# EasyEDA Pro project ProPrj_PCB_2025-05-19.epro, board 手掌0.2
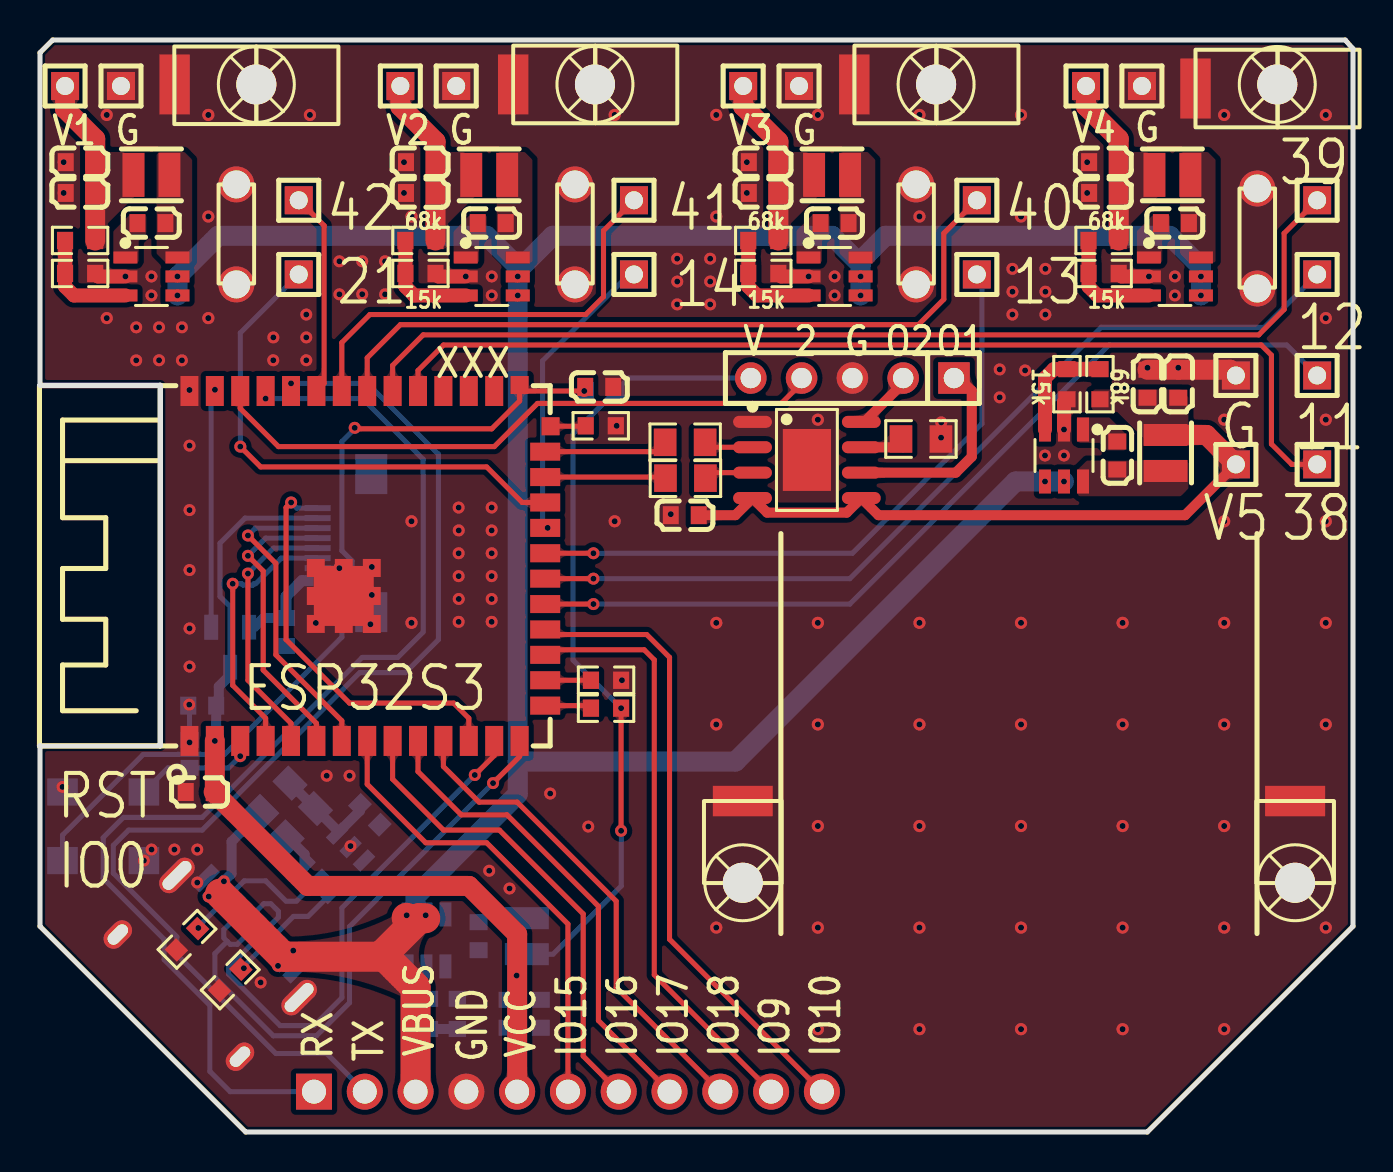
[diagram p12: board, top side]
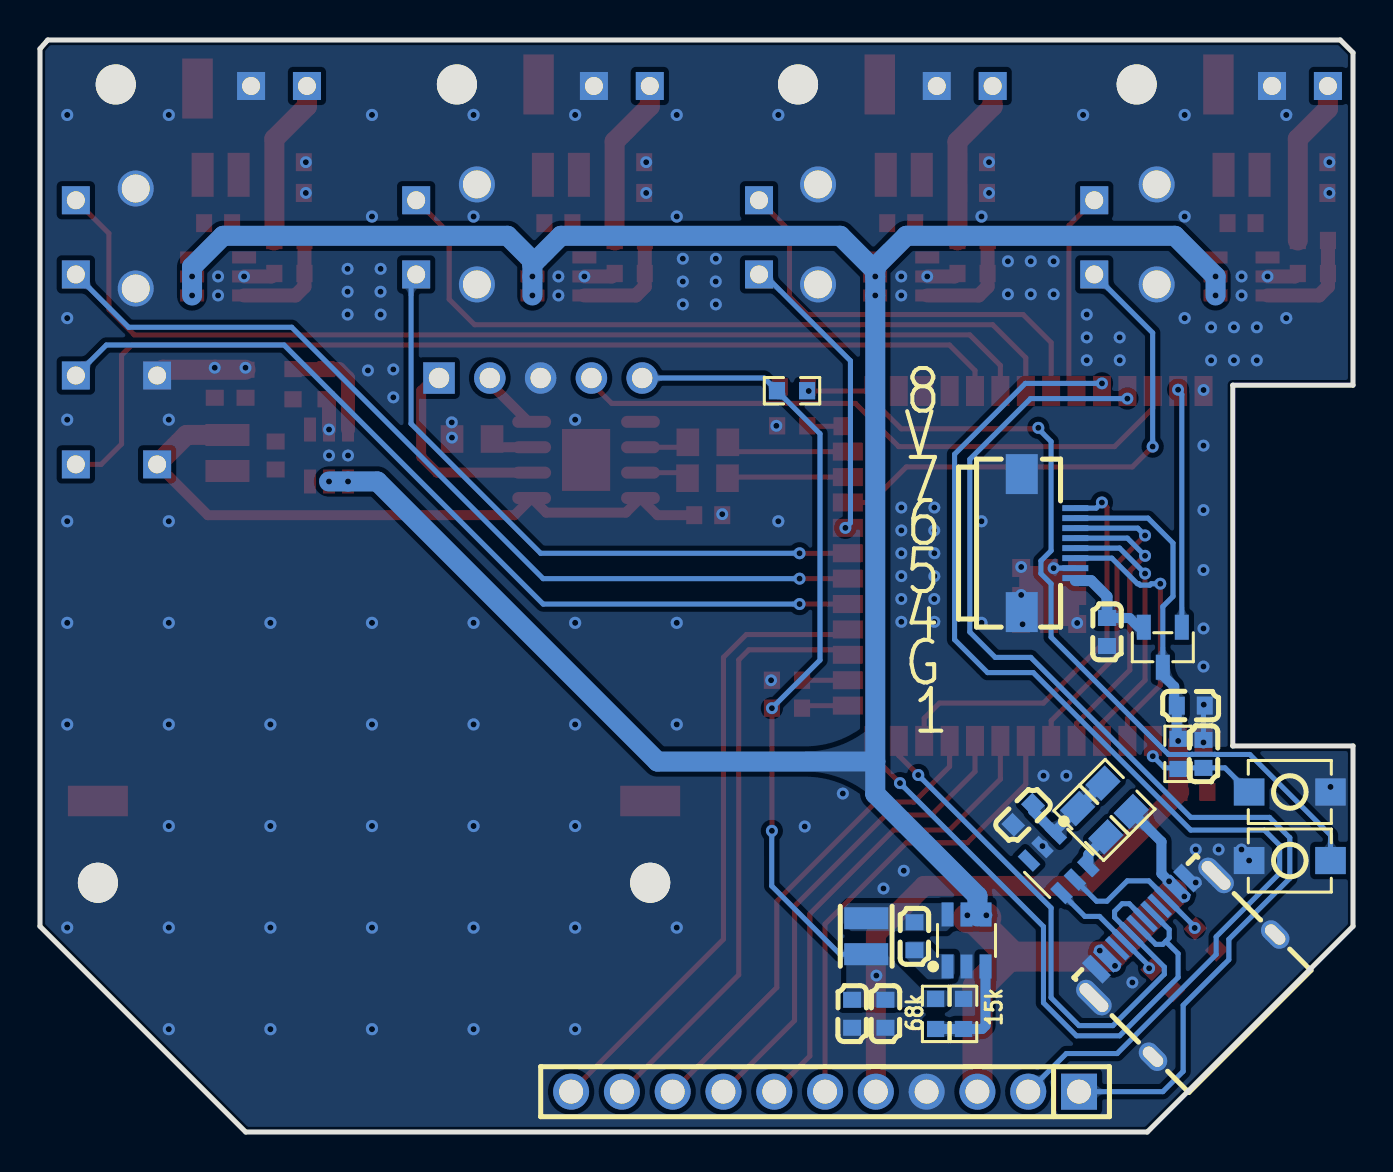
[diagram p13: board, bottom side, seen from below]

Outline 65.66 x 54.61 mm; copper layers: Top Layer, Bottom Layer. Coordinates in mm from the lower left corner of the outline.
Outline path: 0,53.98 0.64,54.61 65.27,54.61 65.66,54.17 65.66,10.29 55.37,0 10.29,0 0,10.29 0,19.31 6.01,19.31 6.01,37.35 0,37.35 0,53.98
Stack: Top Layer 0.035mm / Dielectric1 1.51mm FR4 er 4.5 / Bottom Layer 0.035mm

## Design rules (mm)
template: 自定义配置
spacing copperThickness1oz (default): track to track 0.102, other pairs 0.152 to 0.3
spacing copperThickness2oz: track to track 0.203, other pairs 0.152 to 0.3
track width copperThickness1oz (default): min 0.127, default 0.254, max 2.54
track width copperThickness2oz: min 0.203, default 0.254, max 2.54
differential pair differentialPair (default): width min 0.127, default 0.254, max 2.54; gap min 0.152, default 0.152
via viaSize (default): diameter min 0.5, default 0.61, max 10; hole min 0.3, default 0.305, max 6.3

## Placement (name value [footprint] x y rotation side)
C1  100nF  [C0603]  16.5 15.86 135 bottom
C7  100nF  [C0603]  32.24 30.85 180 top
C9  100nF  [C0603]  7.99 17 0 top
C10  100nF  [C0603]  27.96 37.26 180 top
C11  100nF  [C0603]  7.48 18.91 270 bottom
C24  100nF  [C0603]  12.3 25.01 270 bottom
C25  100nF  [C0603]  8.11 21.32 180 bottom
C26  100nF  [C0603]  21.93 9.79 90 bottom
C27  10uF  [C0603]  25.05 5.91 270 bottom
C28  100nF  [C0603]  23.38 5.91 270 bottom
C29  100nF  [C0603]  5.57 45.45 0 top
C30  10uF  [C0603]  1.98 46.96 180 top
C31  100nF  [C0603]  1.98 48.5 180 top
C32  100nF  [C0603]  22.59 45.45 0 top
C33  10uF  [C0603]  19 48.5 180 top
C34  100nF  [C0603]  19 46.96 180 top
C35  100nF  [C0603]  39.74 45.45 0 top
C36  10uF  [C0603]  36.15 46.96 180 top
C37  100nF  [C0603]  36.15 48.5 180 top
C38  100nF  [C0603]  56.75 45.45 0 top
C39  10uF  [C0603]  53.16 46.96 180 top
C40  100nF  [C0603]  53.16 48.5 180 top
C41  100nF  [C0603]  53.87 33.83 270 top
C42  10uF  [C0603]  56.92 37.42 90 top
C43  100nF  [C0603]  55.38 37.42 90 top
FPC1  AFC01-S08FCA-00  [FPC-SMD_P0.50-8P_FGS-XJ-H2.0]  15.23 29.45 90 bottom
H6  -  [HDR-TH_5P-P2.54-V-F]  40.63 37.71 180 top
H10  -  [HDR-TH_1P-V-M_XKB_X4611WV-01I-C28D40]  1.26 52.31 0 top
H11  -  [HDR-TH_1P-V-M_XKB_X4611WV-01I-C28D40]  4.05 52.31 0 top
H12  -  [HDR-TH_1P-V-M_XKB_X4611WV-01I-C28D40]  12.94 46.6 0 top
H13  -  [HDR-TH_1P-V-M_XKB_X4611WV-01I-C28D40]  12.94 42.89 0 top
H14  -  [HDR-TH_1P-V-M_XKB_X4611WV-01I-C28D40]  18.02 52.31 0 top
H15  -  [HDR-TH_1P-V-M_XKB_X4611WV-01I-C28D40]  20.81 52.31 0 top
H16  -  [HDR-TH_1P-V-M_XKB_X4611WV-01I-C28D40]  29.7 46.6 0 top
H17  -  [HDR-TH_1P-V-M_XKB_X4611WV-01I-C28D40]  29.7 42.89 0 top
H18  -  [HDR-TH_1P-V-M_XKB_X4611WV-01I-C28D40]  35.16 52.31 0 top
H19  -  [HDR-TH_1P-V-M_XKB_X4611WV-01I-C28D40]  37.96 52.31 0 top
H20  -  [HDR-TH_1P-V-M_XKB_X4611WV-01I-C28D40]  46.85 46.6 0 top
H21  -  [HDR-TH_1P-V-M_XKB_X4611WV-01I-C28D40]  46.85 42.89 0 top
H22  -  [HDR-TH_1P-V-M_XKB_X4611WV-01I-C28D40]  52.31 52.31 0 top
H23  -  [HDR-TH_1P-V-M_XKB_X4611WV-01I-C28D40]  55.1 52.31 0 top
H24  -  [HDR-TH_1P-V-M_XKB_X4611WV-01I-C28D40]  63.87 46.6 0 top
H25  -  [HDR-TH_1P-V-M_XKB_X4611WV-01I-C28D40]  63.87 42.89 0 top
H26  -  [HDR-TH_1P-V-M_XKB_X4611WV-01I-C28D40]  59.8 33.39 0 top
H27  -  [HDR-TH_1P-V-M_XKB_X4611WV-01I-C28D40]  59.8 37.83 0 top
H28  -  [HDR-TH_1P-V-M_XKB_X4611WV-01I-C28D40]  63.87 33.39 0 top
H29  -  [HDR-TH_1P-V-M_XKB_X4611WV-01I-C28D40]  63.87 37.83 0 top
H30  -  [HDR-TH_11P-P2.54-V-F]  26.4 2.02 0 bottom
L2  -  [IND-SMD_L2.5-W2.0-B]  24.34 9.79 270 bottom
L3  -  [IND-SMD_L2.5-W2.0-B]  5.57 47.87 180 top
L4  -  [IND-SMD_L2.5-W2.0-B]  22.46 47.87 180 top
L5  -  [IND-SMD_L2.5-W2.0-B]  39.61 47.87 180 top
L6  -  [IND-SMD_L2.5-W2.0-B]  56.63 47.87 180 top
L7  -  [IND-SMD_L2.5-W2.0-B]  56.29 33.96 90 top
NOREF  -  [Pad_e139]  62.76 16.55 270 top
NOREF#2  -  [Pad_e124]  60.87 42.18 270 top
NOREF#3  -  [Pad_e110]  9.82 47.39 270 top
NOREF#4  -  [Pad_e91]  9.82 42.39 270 top
NOREF#5  -  [Pad_e123]  60.87 47.18 270 top
NOREF#6  -  [Pad_e12]  57.78 52.18 0 top
NOREF#7  -  [Pad_e122]  43.81 42.39 270 top
NOREF#8  -  [Pad_e120]  26.75 42.39 270 top
NOREF#9  -  [Pad_e11]  40.72 52.39 0 top
NOREF#10  -  [Pad_e13]  35.14 16.55 270 top
NOREF#11  -  [Pad_e10]  23.66 52.39 0 top
NOREF#12  -  [Pad_e6]  6.73 52.39 0 top
NOREF#13  -  [Pad_e121]  43.81 47.39 270 top
NOREF#14  -  [Pad_e119]  26.75 47.39 270 top
Q1  AO3400A  [SOT-23-3_L2.9-W1.3-P1.90-LS2.4-BR]  9.51 24.24 90 bottom
R11  -  [R0603]  9.51 7.61 225 top
R13  -  [R0603]  7.35 9.64 225 top
R45  10K  [R0603]  28.04 35.32 0 top
R49  10K  [R0603]  28.31 22.59 0 top
R50  10K  [R0603]  8.75 18.91 90 bottom
R51  10K  [R0603]  28.05 37.07 0 bottom
R55  47K  [R0805]  13.07 15.47 225 bottom
R68  10K  [R0805]  32.28 32.7 180 top
R69  10K  [R0805]  32.26 34.49 180 top
R70  5Ω  [R0805]  44.05 34.66 180 top
R71  10K  [R0603]  28.31 21.2 0 top
R77  68k  [R0603]  20.87 5.91 90 bottom
R78  15k  [R0603]  19.48 5.91 270 bottom
R80  68k  [R0603]  2.01 44.58 0 top
R81  15k  [R0603]  2.01 42.93 180 top
R83  68k  [R0603]  19.02 44.58 0 top
R84  15k  [R0603]  19.02 42.93 180 top
R86  68k  [R0603]  36.17 44.58 0 top
R87  15k  [R0603]  36.17 42.93 180 top
R89  68k  [R0603]  53.19 44.58 0 top
R90  15k  [R0603]  53.19 42.93 180 top
R92  68k  [R0603]  53.01 37.4 270 top
R93  15k  [R0603]  51.35 37.4 90 top
R94  1K  [R0805]  11.8 16.74 225 bottom
SW1  -  [Key_SMD_3x4x2]  3.16 17 180 bottom
SW2  -  [Key_SMD_3x4x2]  3.16 13.58 0 bottom
TP1  -  [M2螺丝]  10.82 52.39 0 top
TP2  -  [M2螺丝]  27.75 52.39 0 top
TP3  -  [M2螺丝]  44.81 52.39 0 top
TP4  -  [M2螺丝]  61.87 52.39 0 top
TP7  -  [M2螺丝]  35.14 12.47 270 top
TP9  -  [M2螺丝]  62.76 12.47 0 top
U2  ESP32-S3-WROOM-1-N16R8  [esp32s3-woom-1]  16.37 28.31 90 top
U33  A4950ELJTR-T  [SOIC-8_L4.9-W3.9-P1.27-LS6.0-BL-EP]  38.35 33.61 270 top
U40  CH221K  [SOT-23-6_L2.9-W1.6-P0.95-LS2.9-BL]  14.72 13.44 315 bottom
U42  MT2492  [SOT-23-6_L2.9-W1.6-P0.95-LS2.8-BL_3]  19.33 9.58 180 bottom
U43  MT2492  [SOT-23-6_L2.9-W1.6-P0.95-LS2.8-BL_3]  5.57 42.79 270 top
U44  MT2492  [SOT-23-6_L2.9-W1.6-P0.95-LS2.8-BL_3]  22.59 42.79 270 top
U45  MT2492  [SOT-23-6_L2.9-W1.6-P0.95-LS2.8-BL_3]  39.74 42.79 270 top
U46  MT2492  [SOT-23-6_L2.9-W1.6-P0.95-LS2.8-BL_3]  56.75 42.79 270 top
U47  MT2492  [SOT-23-6_L2.9-W1.6-P0.95-LS2.8-BL_3]  51.21 33.83 180 top
USB1  -  [USB-C-SMD_TYPEC-304-BCP16]  8.75 8.62 135 bottom

## Footprints (pads in the part's own frame, mm; a bottom-side part is the same pattern mirrored in y, then rotated)
C0603
  rect 0.8x0.9 smd: 1(-0.7,0) 2(0.7,0)
esp32s3-woom-1
  rect 1.5x0.9 smd: 1(-8.75,8.895) 2(-8.75,7.625) 3(-8.75,6.355) 4(-8.75,5.085) 5(-8.75,3.815) 6(-8.75,2.545) 7(-8.75,1.275) 8(-8.75,0.005) 9(-8.75,-1.265) 10(-8.75,-2.535) 11(-8.75,-3.805) 12(-8.75,-5.075) 13(-8.75,-6.345) 14(-8.75,-7.615) 28(8.75,-6.345) 29(8.75,-5.075) 30(8.75,-3.805) 31(8.75,-2.535) 32(8.75,-1.265) 33(8.75,0.005) 34(8.75,1.275) 35(8.75,2.545) 36(8.75,3.815) 37(8.75,5.085) 38(8.75,6.355) 39(8.75,7.625) 40(8.75,8.895)
  rect 0.9x1.5 smd: 15(-6.985,-8.895) 16(-5.715,-8.895) 17(-4.445,-8.895) 18(-3.175,-8.895) 19(-1.905,-8.895) 20(-0.635,-8.895) 21(0.635,-8.895) 22(1.905,-8.895) 23(3.175,-8.895) 24(4.445,-8.895) 25(5.715,-8.895)
  rect 0.9x0.9 smd: 26(6.985,-9.165) 27(9.05,-7.615) 41(-2.9,2.575) 41(-2.9,1.175) 41(-2.9,-0.225) 41(-1.5,2.575) 41(-1.5,-0.225) 41(-0.1,2.575) 41(-0.1,1.175) 41(-0.1,-0.225)
  rect 3x3 smd: 41(-1.5,1.175)
FPC-SMD_P0.50-8P_FGS-XJ-H2.0
  rect 0.3x1.3 smd: 1(-1.75,-1.34) 2(-1.252,-1.339) 3(-0.75,-1.34) 4(-0.25,-1.34) 5(0.25,-1.34) 6(0.75,-1.34) 7(1.25,-1.34) 8(1.75,-1.34)
  rect 2x1.6 smd: 9(3.45,1.34) 10(-3.45,1.34)
HDR-TH_1P-V-M_XKB_X4611WV-01I-C28D40
  rect 1.4x1.4 hole 0.9: 1(0,0)
HDR-TH_5P-P2.54-V-F
  rect 1.575x1.575 hole 1.02: 1(-5.08,0)
  round 1.575 hole 1.02: 2(-2.54,0) 3(0,0) 4(2.54,0) 5(5.08,0)
HDR-TH_11P-P2.54-V-F
  rect 1.8x1.8 hole 1.2: 1(-12.7,0)
  round 1.8 hole 1.2: 2(-10.16,0) 3(-7.62,0) 4(-5.08,0) 5(-2.54,0) 6(0,0) 7(2.54,0) 8(5.08,0) 9(7.62,0) 10(10.16,0) 11(12.7,0)
IND-SMD_L2.5-W2.0-B
  rect 1.1x2.2 smd: 1(-0.9,0) 2(0.9,0)
Key_SMD_3x4x2
  rect 1.53x1.36 smd: 1(-2.035,0) 2(2.035,0)
M2螺丝
  round 2 hole 2: 1(0,0)
Pad_e6
  rect 1.524x3 smd: GND(0,0)
Pad_e10
  rect 1.524x3 smd: GND(0,0)
Pad_e11
  rect 1.524x3 smd: GND(0,0)
Pad_e12
  rect 1.524x3 smd: GND(0,0)
Pad_e13
  rect 1.524x3 smd: GND(0,0)
Pad_e91
  round 1.8 hole 1.4: GND(0,0)
Pad_e110
  round 1.8 hole 1.4: GND(0,0)
Pad_e119
  round 1.8 hole 1.4: GND(0,0)
Pad_e120
  round 1.8 hole 1.4: GND(0,0)
Pad_e121
  round 1.8 hole 1.4: GND(0,0)
Pad_e122
  round 1.8 hole 1.4: GND(0,0)
Pad_e123
  round 1.8 hole 1.4: GND(0,0)
Pad_e124
  round 1.8 hole 1.4: GND(0,0)
Pad_e139
  rect 1.524x3 smd: GND(0,0)
R0603
  rect 0.806x0.864 smd: 1(-0.753,0) 2(0.753,0)
R0805
  rect 1.133x1.377 smd: 1(-1,0) 2(1,0)
SOIC-8_L4.9-W3.9-P1.27-LS6.0-BL-EP
  oval 0.602x1.941 smd: 1(-1.905,-2.72) 2(-0.635,-2.72) 3(0.635,-2.72) 4(1.905,-2.72) 5(1.905,2.72) 6(0.635,2.72) 7(-0.635,2.72) 8(-1.905,2.72)
  rect 3.098x2.41 smd: 9(0,0)
SOT-23-3_L2.9-W1.3-P1.90-LS2.4-BR
  rect 1.25x0.7 smd: 1(1,-0.95) 2(1,0.95) 3(-1,0)
SOT-23-6_L2.9-W1.6-P0.95-LS2.8-BL_3
  rect 0.6x1.2 smd: 1(-0.95,-1.3) 2(0,-1.3) 3(0.95,-1.3) 4(0.95,1.3) 5(0,1.3) 6(-0.95,1.3)
SOT-23-6_L2.9-W1.6-P0.95-LS2.9-BL
  rect 0.532x1.072 smd: 1(-0.95,-1.149) 2(0,-1.149) 3(0.95,-1.149) 4(0.95,1.149) 5(0,1.149) 6(-0.95,1.149)
USB-C-SMD_TYPEC-304-BCP16
  oval 1.001x2.1 hole 0.6x1.801: 13(-4.321,1.633) 14(4.321,1.633)
  oval 1.001x1.6 hole 0.6x1.199: 15(-4.321,-2.547) 16(4.321,-2.547)
  rect 0.6x1.45 smd: A1B12(-3.226,2.547) A4B9(-2.451,2.547) B1A12(3.22,2.547) B4A9(2.451,2.547)
  rect 0.299x1.45 smd: A5(-1.249,2.547) A6(-0.249,2.547) A7(0.249,2.547) A8(1.249,2.547) B5(1.75,2.547) B6(0.75,2.547) B7(-0.75,2.547) B8(-1.75,2.547)

## Nets
GND: C1.1 C7.2 C9.1 C10.1 C11.1 C24.2 C25.2 C27.2 C28.2 C30.2 C31.2 C33.2 C34.2 C36.2 C37.2 C39.2 C40.2 C42.2 C43.2 FPC1.2 FPC1.9 FPC1.10 H6.3 H11.1 H15.1 H19.1 H23.1 H27.1 H30.4 NOREF.GND NOREF#2.GND NOREF#3.GND NOREF#4.GND NOREF#5.GND NOREF#6.GND NOREF#7.GND NOREF#8.GND NOREF#9.GND NOREF#10.GND NOREF#11.GND NOREF#12.GND NOREF#13.GND NOREF#14.GND R11.2 R13.2 R45.2 R49.2 R70.1 R78.1 R81.1 R84.1 R87.1 R90.1 R93.1 SW1.2 SW2.2 TP1.1 TP2.1 TP3.1 TP4.1 TP7.1 TP9.1 U2.1 U2.40 U2.41 U33.1 U33.9 U40.2 U42.2 U43.2 U44.2 U45.2 U46.2 U47.2 USB1.13 USB1.14 USB1.15 USB1.16 USB1.A1B12 USB1.B1A12
VBUS: H30.3 R94.2 U42.4 U42.5 U43.4 U43.5 U44.4 U44.5 U45.4 U45.5 U46.4 U46.5 U47.4 U47.5 USB1.A4B9 USB1.B4A9
VCC: C9.2 C25.1 C27.1 C28.1 FPC1.7 H6.5 H30.5 L2.2 Q1.3 R50.2 R51.2 R71.2 R77.2 U2.2
VCC1OUT3V3: C30.1 C31.1 H10.1 L3.2 R80.2
VCC2OUT3V3: C33.1 C34.1 H14.1 L4.2 R83.2
VCC3OUT3V3: C36.1 C37.1 H18.1 L5.2 R86.2
VCC4OUT3V3: C39.1 C40.1 H22.1 L6.2 R89.2
VCC5OUT3V3: C7.1 C42.1 C43.1 H26.1 L7.2 R92.2 U33.4 U33.5
CC1: R11.1 U40.4 USB1.A5
CC2: R13.1 U40.5 USB1.B5
CHIP_PU: C11.2 R50.1 SW1.1 U2.3
D+: U2.14 USB1.A6 USB1.B6
D-: U2.13 USB1.A7 USB1.B7
GPIO0: C10.2 R51.1 SW2.1 U2.27
GPIO1: Q1.1 U2.39
GPIO2: H6.4 U2.38
GPIO3: R71.1 U2.15
GPIO4: FPC1.3 U2.4
GPIO5: FPC1.4 U2.5
GPIO6: FPC1.5 U2.6
GPIO7: FPC1.6 U2.7
GPIO8: FPC1.8 U2.12
GPIO9: H30.10 U2.17
GPIO10: H30.11 U2.18
GPIO11: H29.1 U2.19
GPIO12: H25.1 U2.20
GPIO13: H21.1 U2.21
GPIO14: H17.1 U2.22
GPIO15: H30.6 U2.8
GPIO16: H30.7 U2.9
GPIO17: H30.8 U2.10
GPIO18: H30.9 U2.11
GPIO21: H13.1 U2.23
GPIO35: U2.28
GPIO36: U2.29
GPIO37: U2.30
GPIO38: H28.1 U2.31
GPIO39: H24.1 U2.32
GPIO40: H20.1 U2.33
GPIO41: H16.1 U2.34
GPIO42: H12.1 U2.35
GPIO45: R45.1 U2.26
GPIO46: R49.1 U2.16
GPIO47: R68.2 U2.24
GPIO48: R69.2 U2.25
OUT1: H6.1 U33.6
OUT2: H6.2 U33.8
U0RXD: H30.2 U2.36
U0TXD: H30.1 U2.37
$1N4191: C1.2 R55.1 R94.1 U40.1
$1N4196: R55.2 U40.6
$1N4788: R69.1 U33.2
$1N4792: R68.1 U33.3
$1N5339: R70.2 U33.7
$1N6297: C24.1 FPC1.1 Q1.2
$1N11366: C26.1 U42.1
$1N11371: C26.2 L2.1 U42.6
$1N11492: R77.1 R78.2 U42.3
$1N11847: C29.1 U43.1
$1N11850: C29.2 L3.1 U43.6
$1N11868: R80.1 R81.2 U43.3
$1N12109: C32.1 U44.1
$1N12112: C32.2 L4.1 U44.6
$1N12130: R83.1 R84.2 U44.3
$1N12371: C35.1 U45.1
$1N12374: C35.2 L5.1 U45.6
$1N12392: R86.1 R87.2 U45.3
$1N12633: C38.1 U46.1
$1N12636: C38.2 L6.1 U46.6
$1N12654: R89.1 R90.2 U46.3
$1N12895: C41.1 U47.1
$1N12898: C41.2 L7.1 U47.6
$1N12916: R92.1 R93.2 U47.3

Pads without a net: U40 3; USB1 A8 B8

## Via types
v1: diameter 0.6, hole 0.3, Top Layer to Bottom Layer, 141 vias
v2: diameter 0.61, hole 0.305, Top Layer to Bottom Layer, 57 vias

## Routing (per net, layer and track width the routed paths; a pad name or vN(x,y) marks a point on that pad's centre or on a via; arc(x,y) is an arc through that point)
GND: length 15.3
  Top Layer w0.7: R84.1 19.93,42.79 v1(21.29,42.79) ; R90.1 54.09,42.79 v1(55.45,42.79) ; R81.1 2.91,42.79 v1(4.27,42.79) ; R93.1 51.21,36.5 v1(51.21,35.13) ; v1(38.44,42.79) 37.07,42.79 R87.1
  Top Layer w1: H27.1 59.51,38.12 C42.2 C43.2
  Bottom Layer w0.254: C11.1 7.48,21.36 v1(7.46,21.37) ; FPC1.2 v1(14.97,28.2)
  vias: v1(1.12,17.26) v1(1.18,48.5) v1(1.18,46.96) v1(4.81,40.24) v1(4.81,38.59) v1(5.2,13.58) v1(5.57,42.79) v1(5.57,41.84) v1(5.58,14.13) v1(5.95,40.24) v1(5.95,38.59) v1(6.72,14.13) v1(7.1,40.24) v1(7.1,38.59) v1(7.47,37.11) v1(7.48,34.33) v1(7.48,31.1) v1(7.48,28.1) v1(7.48,25.18) v1(7.48,23.28) v1(7.48,19.48) v1(7.86,14.13) v1(7.86,12.48) v1(11.03,7.48) v1(11.67,39.74) v1(11.66,38.59) v1(13.32,40.88) v1(13.32,39.74) v1(13.32,38.59) v1(13.79,25.46) v1(14.34,17.82) v1(14.97,43.54) v1(14.97,41.89) v1(15.48,17.82) v1(15.53,14.3) v1(16.11,43.54) v1(16.11,41.9) v1(16.52,25.39) v1(16.59,28.26) v1(16.59,26.86) v1(17.26,43.54) v1(17.26,41.89) v1(18.2,48.5) v1(18.2,46.96) v1(20.94,31.23) v1(20.94,30.09) v1(20.94,28.94) v1(20.94,27.8) v1(20.94,26.66) v1(20.94,25.51) v1(22.46,13.07) v1(22.59,42.79) v1(22.59,41.84) v1(22.59,31.23) v1(22.59,30.09) v1(22.59,28.94) v1(22.59,27.8) v1(22.59,26.66) v1(22.59,25.51) v1(23.48,12.18) v1(25.51,16.93) v1(27.42,15.28) v1(28.84,35.32) v1(29.1,22.59) v1(31.54,30.9) v1(31.86,43.67) v1(31.87,42.53) v1(31.86,41.39) v1(33.51,43.67) v1(33.51,42.53) v1(33.51,41.39) v1(35.35,48.5) v1(35.35,46.96) v1(39.74,42.79) v1(39.74,41.84) v1(45.07,35.49) v1(45.06,34.73) v1(47.99,38.14) v1(47.99,36.74) v1(48.63,43.17) v1(48.63,42.02) v1(48.63,40.88) v1(49.26,38.09) v1(50.28,43.17) v1(50.28,42.02) v1(50.28,40.88) v1(50.26,33.83) v1(51.21,33.83) v1(52.36,48.5) v1(52.36,46.96) v1(55.38,38.22) v1(56.75,42.79) v1(56.75,41.84) v1(56.92,38.22) v2(3.34,50.86) v2(3.34,40.7) v2(8.42,50.86) v2(8.42,45.78) v2(8.42,40.7) v2(13.5,50.86) v2(18.58,45.78) v2(18.58,30.54) v2(18.58,25.46) v2(28.74,50.86) v2(28.74,30.54) v2(33.82,50.86) v2(33.82,45.78) v2(33.82,25.46) v2(33.82,20.38) v2(33.82,10.22) v2(38.9,50.86) v2(38.9,35.62) v2(38.9,25.46) v2(38.9,20.38) v2(38.9,15.3) v2(38.9,10.22) v2(38.9,5.14) v2(43.98,50.86) v2(43.98,45.78) v2(43.98,25.46) v2(43.98,20.38) v2(43.98,15.3) v2(43.98,10.22) v2(43.98,5.14) v2(49.06,50.86) v2(49.06,45.78) v2(49.06,25.46) v2(49.06,20.38) v2(49.06,15.3) v2(49.06,10.22) v2(49.06,5.14) v2(54.14,25.46) v2(54.14,20.38) v2(54.14,15.3) v2(54.14,10.22) v2(54.14,5.14) v2(59.22,50.86) v2(59.22,35.62) v2(59.22,30.54) v2(59.22,25.46) v2(59.22,20.38) v2(59.22,15.3) v2(59.22,10.22) v2(59.22,5.14) v2(64.3,50.86) v2(64.3,40.7) v2(64.3,35.62) v2(64.3,30.54) v2(64.3,25.46) v2(64.3,20.38) v2(64.3,10.22)
VBUS: length 153.3
  Top Layer w0.254: v1(11.9,8.31) v1(12.66,9.07) ; v1(8.44,11.78) v1(9.2,12.54)
  Top Layer w1.5: 9.01,11.92 12.16,8.77 17.03,8.77 17.14,8.87 ; 17.14,8.87 18.95,10.69 19.26,10.69 ; 17.14,8.87 18.78,7.23 18.78,2.02 ; 18.34,10.71 18.36,10.69
  Bottom Layer w0.5: R94.2 9.58,14.52 9.58,12.92 v1(9.2,12.54)
  Bottom Layer w1: v1(41.04,41.84) v1(41.04,42.79) 41.04,43.39 ; v1(6.87,41.84) v1(6.87,42.79) 8.91,44.82 22.34,44.82 23.89,43.26 23.89,43.07 ; v1(51.21,32.53) v1(50.26,32.53) 48.79,32.53 34.78,18.53 23.89,18.53 ; 41.04,43.39 39.61,44.82 25.64,44.82 23.89,43.07 ; 41.04,43.39 41.04,43.58 42.28,44.82 56.5,44.82 58.05,43.26 v1(58.05,42.79) v1(58.05,41.84) ; 18.78,10.78 18.78,11.8 23.89,16.91 23.89,18.53 ; 23.89,43.07 v1(23.89,42.79) v1(23.89,41.84) 23.89,18.53
  vias: v1(18.34,10.84) v1(19.29,10.84)
VCC: length 84.1
  Top Layer w0.254: v1(29.06,21.2) v1(29.06,15.06)
  Top Layer w1: 8.74,16.95 13.39,12.31 21.45,12.31 23.86,9.89 H30.5 ; 8.74,16.95 v1(8.74,19.56) ; 8.74,16.95 C9.2
  Bottom Layer w0.254: H6.5 29.44,37.71 R51.2 26.66,34.92 26.66,23.6 v1(29.06,21.2) ; FPC1.7 10.25,30.7 9,29.45 9,26.78 9.51,26.28 Q1.3 ; L2.2 25.66,8.89 29.07,12.31 29.07,14.97
  Bottom Layer w0.5: v1(8.74,19.56) 8.81,19.63 C25.1 ; Q1.3 9.51,22.85 8.94,22.28 8.94,21.32
  vias: v1(23.84,7.82)
VCC1OUT3V3: length 8.3
  Top Layer w1: H10.1 1.26,51.17 2.76,49.66 R80.2
VCC2OUT3V3: length 8.5
  Top Layer w1: R83.2 19.78,49.54 18.02,51.29 H14.1
VCC3OUT3V3: length 8.5
  Top Layer w1: R86.2 36.92,49.54 35.16,51.29 H18.1
VCC4OUT3V3: length 8.4
  Top Layer w1: R89.2 53.94,49.66 52.31,51.29 H22.1
VCC5OUT3V3: length 33.4
  Top Layer w0.5: C7.1 34.77,30.85 U33.4 36.36,30.97 40.34,30.97 U33.5 41.93,30.85 57.26,30.85 H26.1
  Top Layer w1: H26.1 58.33,34.86 L7.2
CC1: length 6.1
  Bottom Layer w0.254: U40.4 13.4,10.78 12.67,10.78 USB1.A5 10.2,8.3 v1(10.2,8.19) 10.26,8.12 10.27,8.12
CC2: length 7.8
  Bottom Layer w0.254: U40.5 12.82,11.54 12.3,11.54 11.29,12.56 10.21,12.56 USB1.B5 7.92,10.27
  vias: v1(7.92,10.2)
CHIP_PU: length 5.6
  Bottom Layer w0.254: v1(10.01,18.8) 9.43,18.21 C11.2 6.4,18.21 SW1.1
D+: length 30.9
  Top Layer w0.254: v1(22.65,17.45) 23.98,18.78 U2.14
  Bottom Layer w0.254: 10.73,10.25 9.86,9.38 9.51,9.38 9.36,9.53 ; 9.36,9.53 9.19,9.7 9.19,10.13 USB1.B6 ; 9.36,9.53 8.75,8.92 8.75,7.73 11.67,4.81 13.83,4.81 15.48,6.46 15.48,10.27 v1(22.65,17.45)
D-: length 29.5
  Top Layer w0.254: v1(21.74,17.85) 22.71,18.82 U2.13
  Bottom Layer w0.254: 10.37,10.6 11.19,11.42 11.54,11.42 11.92,11.04 11.92,10.74 USB1.B7 9.44,8.25 9.44,7.89 12.01,5.32 13.7,5.32 15.1,6.72 15.1,11.21 v1(21.74,17.85)
GPIO0: length 43.4
  Top Layer w0.254: 27.26,37.01 v1(27.22,37.06) 23.98,37.06 ; 23.98,37.06 U2.27 ; 23.98,37.06 23.98,36.56 22.59,35.17 15.79,35.17 v1(15.74,35.22)
  Bottom Layer w0.254: 15.73,35.17 15.1,34.53 15.1,29.07 15.61,28.56 15.61,27.93 15.1,27.42 15.1,24.75 9.23,18.88 8.05,18.88 8.04,18.89 6.91,18.89 6.9,18.88 5.16,18.88 1.12,14.85 1.12,13.58
GPIO1: length 11.9
  Bottom Layer w0.254: 8.75,37.07 8.56,36.88 Q1.1
  vias: v1(8.75,37.12)
GPIO2: length 31.4
  Top Layer w0.254: 38.34,37.71 37.07,36.44 24.88,36.44 22.72,34.28 11.92,34.28 10.01,36.19 U2.38
GPIO3: length 2.3
  Top Layer w0.254: R71.1 27.43,21.32 U2.15
GPIO4: length 13.4
  Top Layer w0.254: v1(9.64,27.42) 9.64,22.34 11.28,20.69 U2.4
  Bottom Layer w0.254: FPC1.3 12.06,28.7 10.78,27.42 10.71,27.42 10.64,27.35 10.16,27.35 10.09,27.42 v1(9.64,27.42)
GPIO5: length 13.3
  Top Layer w0.254: U2.5 12.55,20.44 10.4,22.59 v1(10.4,27.93)
  Bottom Layer w0.254: FPC1.4 11.67,29.2 v1(10.4,27.93)
GPIO6: length 14.5
  Top Layer w0.254: U2.6 13.82,20.44 11.16,23.1 11.16,28.05 v1(10.4,28.82)
  Bottom Layer w0.254: v1(10.4,28.82) 11.28,29.7 FPC1.5
GPIO7: length 15.9
  Top Layer w0.254: U2.7 15.09,20.57 11.8,23.86 11.8,28.43 v1(10.4,29.83)
  Bottom Layer w0.254: FPC1.6 10.77,30.2 v1(10.4,29.83)
GPIO8: length 20.3
  Top Layer w0.254: v1(12.56,31.48) 12.3,31.23 12.3,24.62 15.48,21.45 20.69,21.45 21.44,20.69 U2.12
  Bottom Layer w0.254: v1(12.56,31.48) 12.84,31.2 FPC1.8
GPIO9: length 29.8
  Top Layer w0.254: U2.17 25.52,24.12 30.21,24.12 30.72,23.61 30.72,7.86 H30.10
GPIO10: length 31.7
  Top Layer w0.254: U2.18 25.52,24.88 30.34,24.88 31.48,23.73 31.48,9.64 H30.11
GPIO11: length 44.6
  Top Layer w0.254: U2.19 v1(27.68,26.4)
  Bottom Layer w0.254: v1(27.68,26.4) 40.5,26.4 53.45,39.36 62.34,39.36 H29.1
GPIO12: length 44.9
  Top Layer w0.254: U2.20 v1(27.68,27.67)
  Bottom Layer w0.254: v1(27.68,27.67) 40.5,27.67 53.07,40.25 61.23,40.25 H25.1
GPIO13: length 32.1
  Top Layer w0.254: U2.21 v1(27.68,28.94)
  Bottom Layer w0.254: v1(27.68,28.94) 40.63,28.94 47.1,35.42 47.1,42.63 H21.1
GPIO14: length 14.9
  Top Layer w0.254: U2.22 v1(25.39,30.21)
  Bottom Layer w0.254: H17.1 29.45,42.89 25.13,38.57 25.13,30.47 v1(25.39,30.21)
GPIO15: length 23.5
  Top Layer w0.254: U2.8 16.36,17.39 19.29,14.46 22.34,14.46 26.4,10.4 H30.6
GPIO16: length 23.9
  Top Layer w0.254: H30.7 27.16,3.8 27.16,10.91 22.97,15.1 20.18,15.1 17.63,17.64 U2.9
GPIO17: length 24.1
  Top Layer w0.254: H30.8 27.92,5.57 27.92,11.29 23.35,15.86 21.07,15.86 18.9,18.03 U2.10
GPIO18: length 24.4
  Top Layer w0.254: H30.9 28.81,7.23 28.81,11.54 23.86,16.5 21.96,16.5 20.17,18.28 U2.11
GPIO21: length 26.2
  Top Layer w0.254: U2.23 24.11,31.48 22.34,33.26 11.03,33.26 v1(10.02,34.28)
  Bottom Layer w0.254: H13.1 10.02,39.96 v1(10.02,34.28)
GPIO38: length 51.6
  Top Layer w0.254: U2.31 18.9,38.08 20.18,39.36 61.07,39.36 61.58,38.85 61.58,34.4 62.6,33.39 H28.1
GPIO39: length 53.2
  Top Layer w0.254: H24.1 62.22,44.94 62.22,41.13 60.95,39.86 19.16,39.86 17.63,38.33 U2.32
GPIO40: length 37.3
  Top Layer w0.254: U2.33 16.36,38.72 18.02,40.37 43.93,40.37 45.2,41.64 45.2,44.94 H20.1
GPIO41: length 21.9
  Top Layer w0.254: U2.34 15.09,39.48 16.5,40.88 27.29,40.88 28.18,41.77 28.18,45.07 H16.1
GPIO42: length 10.2
  Top Layer w0.254: U2.35 14.21,37.44 14.21,45.33 H12.1
GPIO45: length 2.1
  Top Layer w0.254: R45.1 27.26,35.29 25.23,35.29
GPIO46: length 2.3
  Top Layer w0.254: R49.1 U2.16
GPIO47: length 6
  Top Layer w0.254: U2.24 31.22,32.75 R68.2
GPIO48: length 6.2
  Top Layer w0.254: U2.25 30.79,34.02 R69.2
OUT1: length 10.1
  Top Layer w0.5: 45.96,37.71 46.59,37.07 46.59,33.77 45.8,32.97 U33.6
OUT2: length 3.3
  Top Layer w0.5: 43.42,37.71 41.23,35.51 U33.8
U0RXD: length 57.6
  Bottom Layer w0.254: v1(12.55,37.44) 16.38,37.44 19.92,33.9 19.92,24.62 18.27,22.97 15.99,22.97 8.11,15.1 4.43,15.1 3.67,14.34 3.67,12.94 6.84,9.77 6.84,8.88 11.8,3.92 14.34,3.92 H30.2
U0TXD: length 57.6
  Bottom Layer w0.254: H30.1 9.51,2.02 8.49,3.03 8.49,6.34 6.21,8.62 6.21,9.64 3.16,12.69 3.16,14.72 4.18,15.73 8.11,15.73 16.11,23.73 17.89,23.73 19.16,25.01 19.16,33.64 16.13,36.68 v1(11.28,36.68)
$1N4191: length 5.4
  Bottom Layer w0.5: C1.2 16,16.06 U40.1 14.86,15.09 13.77,16.18 R94.1
$1N4196: length 1.8
  Bottom Layer w0.5: 12.36,14.76 13.23,13.89 U40.6
$1N4788: length 2.5
  Top Layer w0.254: U33.2 33.51,34.24 R69.1
$1N4792: length 2.5
  Top Layer w0.254: R68.1 33.55,32.97 U33.3
$1N5339: length 2.1
  Top Layer w0.5: 43.18,34.28 43.15,34.24 U33.7
$1N6297: length 4.9
  Bottom Layer w0.5: C24.1 11.18,25.71 10.71,25.24
  Bottom Layer w0.55: 12.3,25.58 C24.1 12.3,26.78 13.09,27.57 13.89,27.57
$1N11492: length 5.5
  Bottom Layer w0.5: R77.1 18.55,5.15 18.38,5.32 U42.3
$1N11868: length 5.5
  Top Layer w0.7: R80.1 R81.2 1.25,42.28 1.7,41.84 U43.3
$1N12130: length 5.5
  Top Layer w0.7: R83.1 R84.2 18.27,42.28 18.72,41.84 21.29,41.84
$1N12392: length 5.5
  Top Layer w0.7: U45.3 35.86,41.84 35.42,42.28 R87.2 R86.1
$1N12654: length 5.5
  Top Layer w0.7: R89.1 R90.2 52.43,42.28 52.88,41.84 U46.3
$1N12916: length 5.5
  Top Layer w0.7: R92.1 R93.2 50.7,38.15 50.26,37.71 U47.3

## Copper pours and planes (outline as drawn; the poured copper is in the pictures)
GND on Top Layer: -3.7,58.15 68.44,58.15 68.44,-5.6 -3.7,-5.6
GND on Bottom Layer: -3.95,55.61 70.98,55.61 70.98,-4.08 -3.95,-4.08
VCC on Bottom Layer: 20.3,7.1 21.53,7.1 23.31,8.88 23.31,9.36 25.34,9.36 25.34,6.35 25.23,6.24 20.41,6.24 20.3,6.35
VCC1OUT3V3 on Top Layer: 4.18,49.01 2.65,49.01 2.27,48.63 2.27,44.31 2.4,44.18 3.25,44.18 3.39,44.32 3.39,45.44 4.81,46.86 4.81,48.38
VCC2OUT3V3 on Top Layer: 21.2,49.01 19.67,49.01 19.29,48.63 19.29,44.31 19.42,44.18 20.27,44.18 20.41,44.32 20.41,45.44 21.83,46.86 21.83,48.38
VCC3OUT3V3 on Top Layer: 38.34,49.01 36.82,49.01 36.43,48.63 36.43,44.31 36.56,44.18 37.41,44.18 37.55,44.32 37.55,45.44 38.97,46.86 38.97,48.38
VCC4OUT3V3 on Top Layer: 55.36,49.01 53.83,49.01 53.45,48.63 53.45,44.31 53.58,44.18 54.43,44.18 54.57,44.32 54.57,45.44 55.99,46.86 55.99,48.38
VCC5OUT3V3 on Top Layer: 57.43,35.23 57.43,36.75 57.05,37.13 52.73,37.13 52.6,37.01 52.6,36.15 52.74,36.01 53.86,36.01 55.28,34.59 56.8,34.59
$1N11366 on Bottom Layer: 22.34,8.7 21.27,7.63 20.18,7.63 19.92,7.9 19.92,8.9 20.79,8.9 21.42,9.54 22.34,9.54
$1N11371 on Bottom Layer: 20.03,11.44 25.23,11.44 25.49,11.19 25.49,10.43 25.11,10.05 20.32,10.05 20.02,10.35 20.02,11.44
$1N11847 on Top Layer: 3.67,45.05 4.48,45.86 5.29,45.86 5.32,45.83 5.32,44.94 4.94,44.56 4.94,43.54 4.89,43.5 4.81,43.42 3.67,43.42
$1N11850 on Top Layer: 5.83,48.88 5.83,43.93 6.27,43.48 7.54,43.48 7.61,43.55 7.61,48.63 7.22,49.01 5.95,49.01
$1N12109 on Top Layer: 20.69,45.05 21.5,45.86 22.31,45.86 22.34,45.83 22.34,44.94 21.96,44.56 21.96,43.54 21.91,43.5 21.83,43.42 20.69,43.42
$1N12112 on Top Layer: 22.85,48.88 22.85,43.93 23.29,43.48 24.56,43.48 24.62,43.55 24.62,48.63 24.24,49.01 22.97,49.01
$1N12371 on Top Layer: 39.45,45.86 39.48,45.83 39.48,44.94 39.1,44.56 39.1,43.54 39.05,43.5 38.97,43.42 37.83,43.42 37.83,45.07 38.62,45.86
$1N12374 on Top Layer: 39.99,48.88 39.99,43.93 40.44,43.48 41.7,43.48 41.77,43.55 41.77,48.63 41.39,49.01 40.12,49.01
$1N12633 on Top Layer: 54.85,45.05 55.66,45.86 56.47,45.86 56.5,45.83 56.5,44.94 56.12,44.56 56.12,43.54 56.07,43.5 55.99,43.42 54.85,43.42
$1N12636 on Top Layer: 57.01,48.88 57.01,43.93 57.45,43.48 58.72,43.48 58.79,43.55 58.79,48.63 58.41,49.01 57.14,49.01
$1N12895 on Top Layer: 53.47,35.74 54.28,34.93 54.28,34.11 54.25,34.09 53.36,34.09 52.98,34.47 51.97,34.47 51.92,34.51 51.84,34.59 51.84,35.74
$1N12898 on Top Layer: 57.3,33.58 52.35,33.58 51.9,33.13 51.9,31.87 51.97,31.8 57.05,31.8 57.43,32.18 57.43,33.45

Small or netless copper shapes (teardrops, artwork), in the pictures only: 103 on Top Layer, 66 on Bottom Layer

## Text on the board
Bottom Silkscreen Layer: 15k | 68k | 1 | 6 | 8 | 7 | 5 | 4 | G | V
Top Silkscreen Layer: 68k | 15k | V1 | G | V2 | X | V3 | V | 2 | O2 | O1 | V4 | RX | TX | VBUS | GND | VCC | IO15 | IO16 | IO17 | IO18 | IO9 | IO10 | RST | IO0 | ESP32S3 | 42 | 21 | 41 | 14 | 40 | 13 | V5 | 39 | 38 | 11 | 12
